# EAGLE board fiberInterface_revC_V3 (EAGLE 9.1.1)
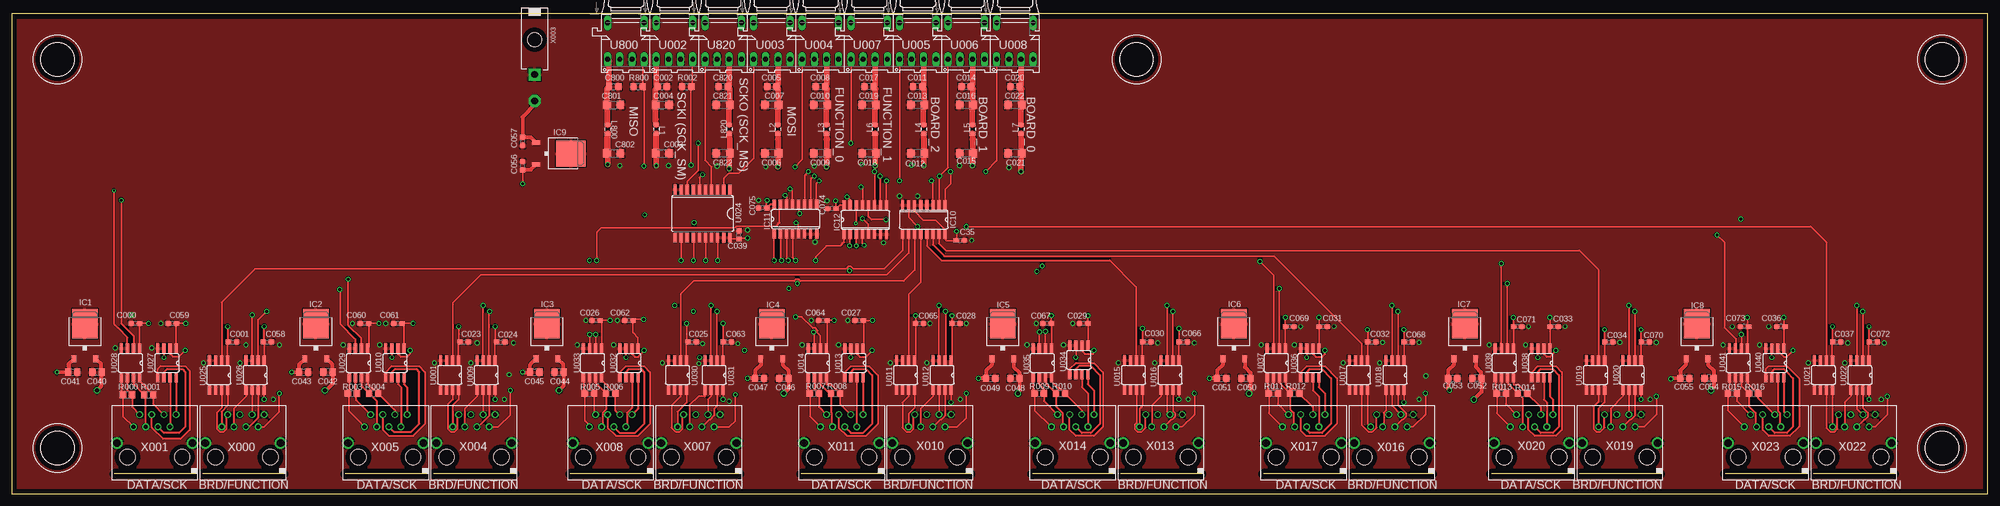
[diagram p2: board, top side]
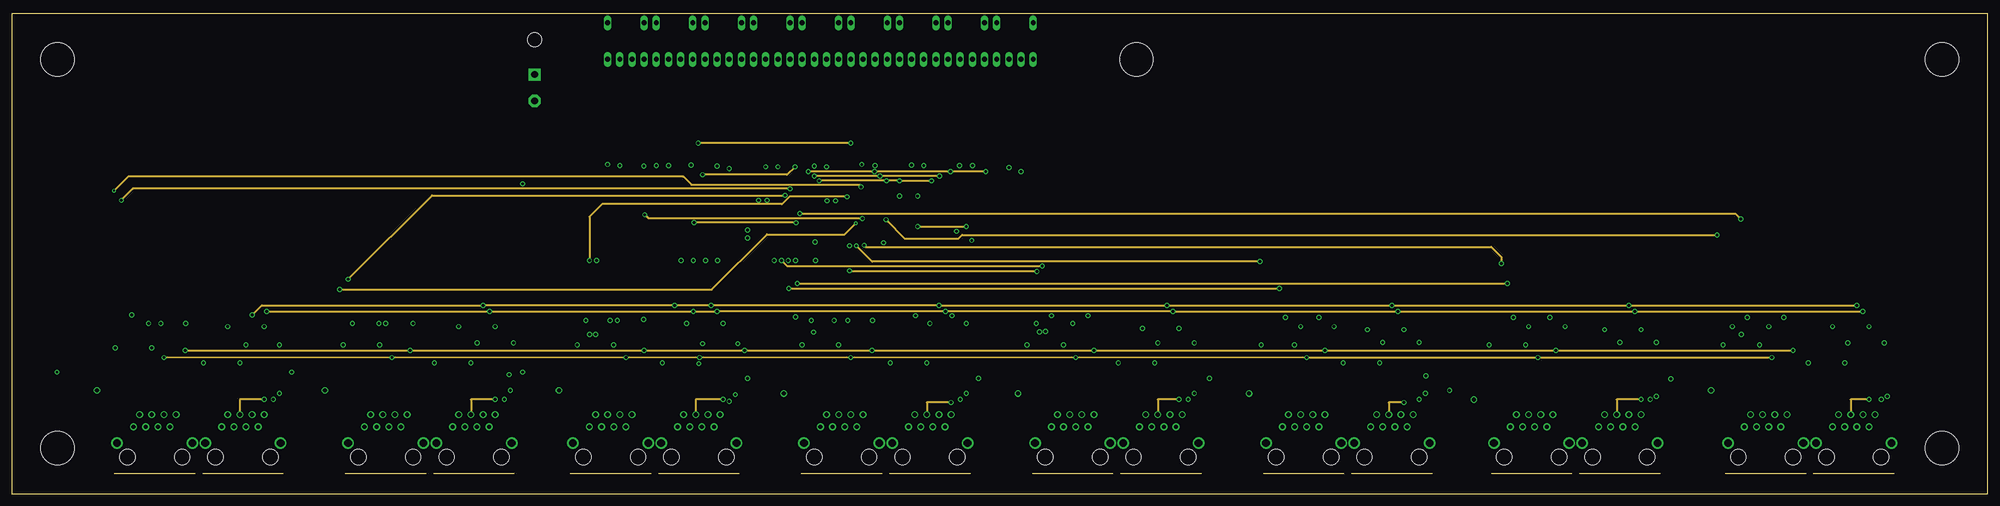
[diagram p3: board, inner layer Signal]
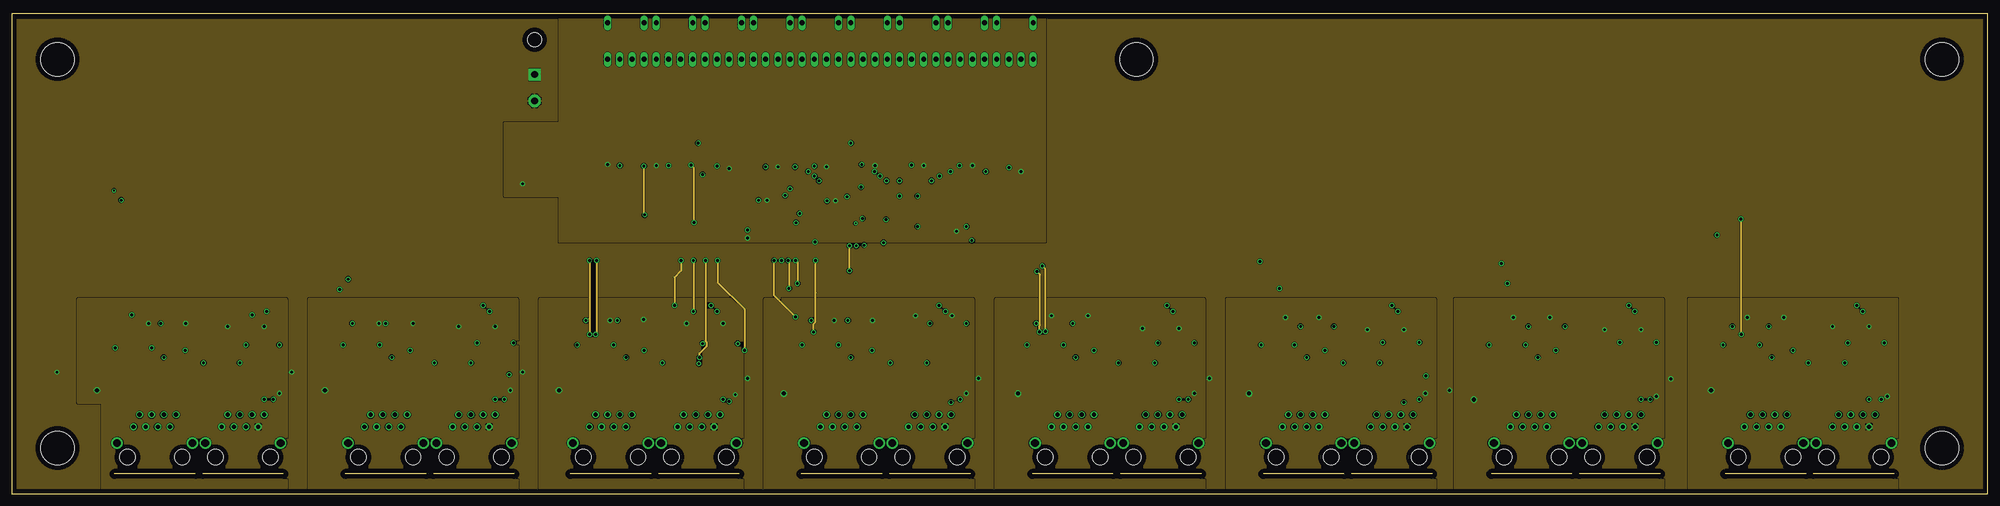
[diagram p4: board, inner layer VCC]
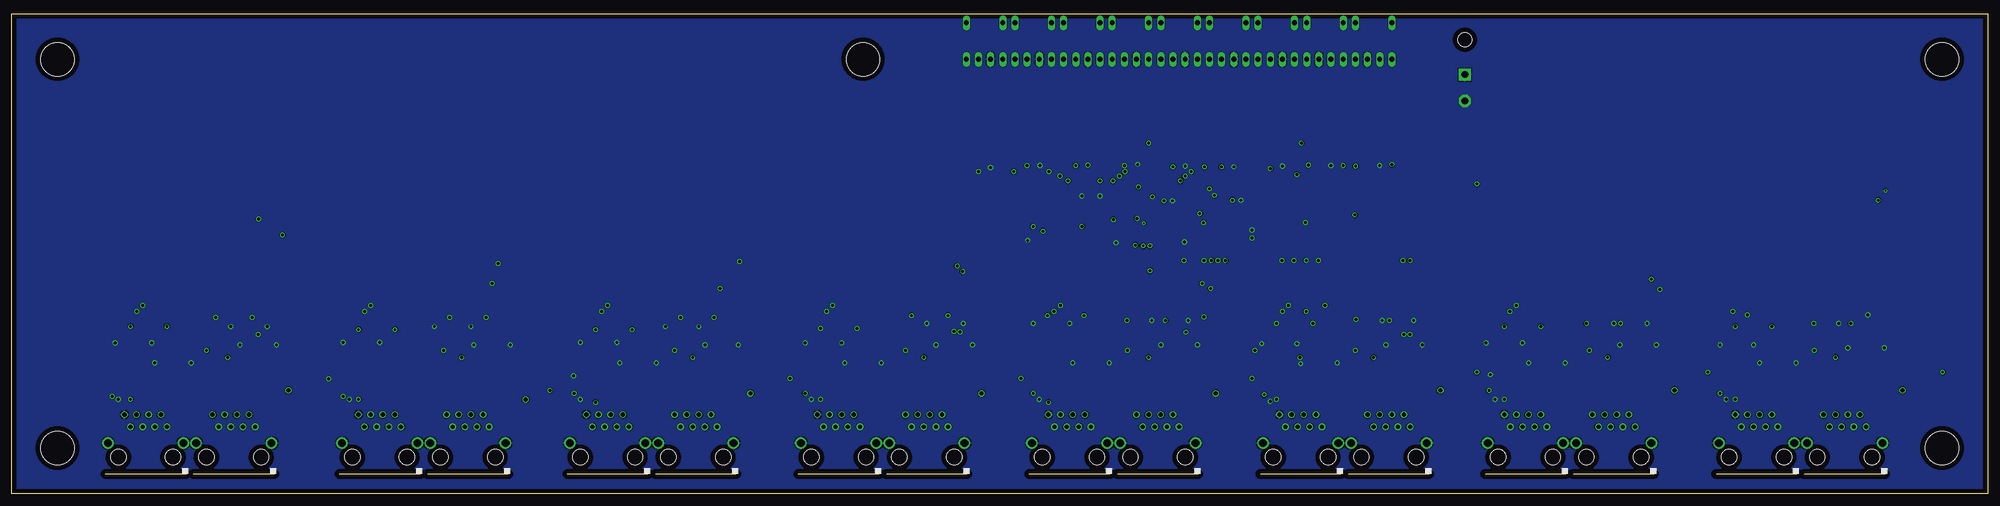
[diagram p5: board, bottom side, seen from below]

Size 412.75 x 100.33 mm. Coordinates in mm from the lower left corner, seen from the top.
Outline: 0,0 412.75,0 412.75,100.33 0,100.33 0,0
Copper layers (1*2*15*16): GND_TOP 0.035mm / dielectric 0.5mm / Signal 0.035mm / dielectric 0.5mm / VCC 0.035mm / dielectric 0.5mm / GND_BOTTOM 0.035mm
Design rules "default *": minimum track width 10mil, minimum drill 10mil, track to track 5mil, track to pad 5mil, pad to pad 8mil, via to via 8mil, smd to smd 8mil, copper to edge 40mil, drill to drill 8mil, minimum pad ring 10mil, minimum via ring 8mil, stop-mask expansion 4mil, vias tented up to drill 0mil, thermal gap 10mil
Holes 6.99 mm at 403.23,9.53 9.53,90.81 403.23,90.81 234.95,90.81 9.53,9.53
tKeepout: area 398.1,4.4 to 408.3,14.6; area 4.4,85.7 to 14.6,95.9; area 398.1,85.7 to 408.3,95.9; area 229.9,85.7 to 240,95.9; area 4.4,4.4 to 14.6,14.6

## Footprints (pad centres in the part's own frame; a part is rotated, then mirrored left to right if it is on the bottom)
C0603 = smd 1.1 x 1: 1 -0.85,0; 2 0.85,0
C0805 = smd 1.3 x 1.5: 1 -0.95,0; 2 0.95,0
C1206 = smd 1.6 x 1.8: 1 -1.4,0; 2 1.4,0
TO252 = smd 1 x 1.6: 1 -2.28,-4.8; 2 2.28,-4.8 | smd 5.4 x 6.2: 3 0,2.5
SO16 = smd 0.66 x 2.032: 1 -4.445,-3.073; 2 -3.175,-3.073; 3 -1.905,-3.073; 4 -0.635,-3.073; 5 0.635,-3.073; 6 1.905,-3.073; 7 3.175,-3.073; 8 4.445,-3.073; 9 4.445,3.073; 10 3.175,3.073; 11 1.905,3.073; 12 0.635,3.073; 13 -0.635,3.073; 14 -1.905,3.073; 15 -3.175,3.073; 16 -4.445,3.073
0805 = smd 0.8 x 1.2: 1 -0.9,0; 2 0.9,0
R0805 = smd 1.3 x 1.5: 1 -0.95,0; 2 0.95,0
SO08-1 = smd 0.66 x 2.032: 1 -1.905,-3.073; 2 -0.635,-3.073; 3 0.635,-3.073; 4 1.905,-3.073; 5 1.905,3.073; 6 0.635,3.073; 7 -0.635,3.073; 8 -1.905,3.073
HFBR-15X3 = drill 1.016 long: 1 3.81,9.525; 2 1.27,9.525; 3 -1.27,9.525; 4 -3.81,9.525; 5 -3.81,1.905; 8 3.81,1.905
SO20W = smd 0.66 x 2.032: 1 -5.715,-5.029; 2 -4.445,-5.029; 3 -3.175,-5.029; 4 -1.905,-5.029; 5 -0.635,-5.029; 6 0.635,-5.029; 7 1.905,-5.029; 8 3.175,-5.029; 9 4.445,-5.029; 10 5.715,-5.029; 11 5.715,5.029; 12 4.445,5.029; 13 3.175,5.029; 14 1.905,5.029; 15 0.635,5.029; 16 -0.635,5.029; 17 -1.905,5.029; 18 -3.175,5.029; 19 -4.445,5.029; 20 -5.715,5.029
RJ45-VERTICAL = drill 0.9 pad 1.4: 1 -4.445,6.35; 2 -3.175,8.89; 3 -1.905,6.35; 4 -0.635,8.89; 5 0.635,6.35; 6 1.905,8.89; 7 3.175,6.35; 8 4.445,8.89 | drill 1.6 pad 2.1: G1 -7.875,2.95; G2 7.875,2.95 | hole 3.251: -5.715,0; 5.715,0
39-30-?02? = drill 1.422 pad 2.54 square: 1 0,0 | drill 1.422 pad 2.54 octagon: 2 0,5.512 | hole 3: 0,-7.3

## Placement (x,y rotation side)
C000  0.1uF  [C0603]  25.78,35.56 180 top
C001  0.1uF  [C0603]  46.1,31.75 0 top
C002  100n  [C0805]  135.89,85.09 0 top
C003  10u  [C1206]  135.89,71.12 0 top
C004  10u  [C1206]  135.89,81.28 0 top
C005  100n  [C0805]  158.75,85.09 180 top
C006  10u  [C1206]  158.75,71.12 180 top
C007  10u  [C1206]  158.75,81.28 180 top
C008  100n  [C0805]  168.91,85.09 180 top
C009  10u  [C1206]  168.91,71.12 180 top
C010  10u  [C1206]  168.91,81.28 180 top
C011  100n  [C0805]  189.23,85.09 180 top
C012  10u  [C1206]  189.23,71.12 180 top
C013  10u  [C1206]  189.23,81.28 180 top
C014  100n  [C0805]  199.39,85.09 180 top
C015  10u  [C1206]  199.39,71.12 180 top
C016  10u  [C1206]  199.39,81.28 180 top
C017  100n  [C0805]  179.07,85.09 180 top
C018  10u  [C1206]  179.07,71.12 180 top
C019  10u  [C1206]  179.07,81.28 180 top
C020  100n  [C0805]  209.55,85.09 180 top
C021  10u  [C1206]  209.55,71.12 180 top
C022  10u  [C1206]  209.55,81.28 180 top
C023  0.1uF  [C0603]  94.49,31.75 0 top
C024  0.1uF  [C0603]  102.11,31.75 0 top
C025  0.1uF  [C0603]  142.11,31.75 0 top
C026  0.1uF  [C0603]  122.05,36.2 180 top
C027  0.1uF  [C0603]  177.04,36.2 180 top
C028  0.1uF  [C0603]  197.23,35.56 0 top
C029  0.1uF  [C0603]  223.9,35.56 180 top
C030  0.1uF  [C0603]  237.11,31.75 0 top
C031  0.1uF  [C0603]  273.94,34.92 0 top
C032  0.1uF  [C0603]  284.1,31.75 0 top
C033  0.1uF  [C0603]  322.2,34.92 0 top
C034  0.1uF  [C0603]  333.63,31.75 0 top
C35  0.1uF  [C0603]  198.12,52.96 0 top
C036  0.1uF  [C0603]  369.57,34.92 180 top
C037  0.1uF  [C0603]  381.25,31.75 0 top
C039  0.1uF  [C0603]  151.89,54.1 90 top
C040  0.1uF  [C0805]  17.78,25.4 180 top
C041  0.33uF  [C0805]  12.7,25.4 0 top
C042  0.1uF  [C0805]  66.04,25.4 180 top
C043  0.33uF  [C0805]  60.96,25.4 0 top
C044  0.1uF  [C0805]  114.3,25.4 180 top
C045  0.33uF  [C0805]  109.22,25.4 0 top
C046  0.1uF  [C0805]  161.29,24.13 180 top
C047  0.33uF  [C0805]  156.21,24.13 0 top
C048  0.1uF  [C0805]  209.55,24.13 180 top
C049  0.33uF  [C0805]  204.47,24.13 0 top
C050  0.1uF  [C0805]  257.81,24.13 180 top
C051  0.33uF  [C0805]  252.73,24.13 0 top
C052  0.1uF  [C0805]  306.07,24.13 180 top
C053  0.33uF  [C0805]  300.99,24.13 0 top
C054  0.1uF  [C0805]  354.58,24.13 180 top
C055  0.33uF  [C0805]  349.5,24.13 0 top
C056  0.1uF  [C0603]  106.68,68.58 90 top
C057  0.1uF  [C0603]  106.68,73.66 270 top
C058  0.1uF  [C0603]  53.34,31.75 0 top
C059  0.1uF  [C0603]  33.53,35.56 180 top
C060  0.1uF  [C0603]  73.66,35.56 180 top
C061  0.1uF  [C0603]  80.64,35.56 180 top
C062  0.1uF  [C0603]  128.91,36.2 180 top
C063  0.1uF  [C0603]  149.48,31.75 0 top
C064  0.1uF  [C0603]  169.42,36.2 180 top
C065  0.1uF  [C0603]  189.61,35.56 0 top
C066  0.1uF  [C0603]  244.73,31.75 0 top
C067  0.1uF  [C0603]  216.28,35.56 180 top
C068  0.1uF  [C0603]  291.72,31.75 0 top
C069  0.1uF  [C0603]  266.95,34.92 0 top
C070  0.1uF  [C0603]  341.25,31.75 0 top
C071  0.1uF  [C0603]  314.58,34.92 0 top
C072  0.1uF  [C0603]  388.87,31.75 0 top
C073  0.1uF  [C0603]  361.95,34.92 180 top
C074  0.1uF  [C0603]  171.32,59.56 180 top
C075  0.1uF  [C0603]  156.84,59.69 180 top
C800  100n  [C0805]  125.73,85.09 0 top
C801  10u  [C1206]  125.73,81.28 0 top
C802  10u  [C1206]  125.73,71.12 0 top
C820  100n  [C0805]  148.59,85.09 180 top
C821  10u  [C1206]  148.59,81.28 180 top
C822  10u  [C1206]  148.59,71.12 180 top
IC1  7833  [TO252]  15.24,33.02 0 top
IC2  7833  [TO252]  63.5,33.02 0 top
IC3  7833  [TO252]  111.76,33.02 0 top
IC4  7833  [TO252]  158.75,33.02 0 top
IC5  7833  [TO252]  207.01,33.02 0 top
IC6  7833  [TO252]  255.27,33.02 0 top
IC7  7833  [TO252]  303.53,33.02 0 top
IC8  7833  [TO252]  352.04,33.02 0 top
IC9  7805DT  [TO252]  114.3,71.12 270 top
IC10  74LS138D  [SO16]  190.5,57.28 180 top
IC11  74LS151D  [SO16]  163.7,57.4 0 top
IC12  74LS151D  [SO16]  178.31,57.28 0 top
L1  1u  [0805]  134.62,76.2 270 top
L2  1u  [0805]  160.02,76.2 270 top
L3  1u  [0805]  170.18,76.2 270 top
L4  1u  [0805]  190.5,76.2 270 top
L5  1u  [0805]  200.66,76.2 270 top
L6  1u  [0805]  180.34,76.2 270 top
L7  1u  [0805]  210.82,76.2 270 top
L800  1u  [0805]  124.46,76.2 270 top
L820  1u  [0805]  149.86,76.2 270 top
R000  100  [R0805]  24.13,20.7 0 top
R001  100  [R0805]  28.57,20.7 0 top
R002  4.7k  [R0805]  140.97,85.09 0 top
R003  100  [R0805]  71.12,20.95 0 top
R004  100  [R0805]  75.56,20.95 0 top
R005  100  [R0805]  120.65,20.95 0 top
R006  100  [R0805]  125.09,20.95 0 top
R007  100  [R0805]  167.64,20.95 0 top
R008  100  [R0805]  172.09,20.95 0 top
R009  100  [R0805]  214.63,20.95 0 top
R010  100  [R0805]  219.07,20.95 0 top
R011  100  [R0805]  263.52,20.95 0 top
R012  100  [R0805]  267.97,20.95 0 top
R013  100  [R0805]  311.15,20.95 0 top
R014  100  [R0805]  315.6,20.95 0 top
R015  100  [R0805]  359.41,20.95 0 top
R016  100  [R0805]  363.86,20.95 0 top
R800  4.7k  [R0805]  130.81,85.09 0 top
U001  65LVDS9638  [SO08-1]  91.44,24.77 180 top
U002  AFBR-1629Z  [HFBR-15X3]  138.43,100.33 180 top
U003  AFBR-2529Z  [HFBR-15X3]  158.75,100.33 180 top
U004  AFBR-2529Z  [HFBR-15X3]  168.91,100.33 180 top
U005  AFBR-2529Z  [HFBR-15X3]  189.23,100.33 180 top
U006  AFBR-2529Z  [HFBR-15X3]  199.39,100.33 180 top
U007  AFBR-2529Z  [HFBR-15X3]  179.07,100.33 180 top
U008  AFBR-2529Z  [HFBR-15X3]  209.55,100.33 180 top
U009  65LVDS9638  [SO08-1]  99.06,24.77 180 top
U010  65LVDS9638  [SO08-1]  80.01,27.3 180 top
U011  65LVDS9638  [SO08-1]  186.69,24.77 180 top
U012  65LVDS9638  [SO08-1]  194.31,24.77 180 top
U013  65LVDS9638  [SO08-1]  175.9,27.3 180 top
U014  65LVDS34  [SO08-1]  168.28,27.3 180 top
U015  65LVDS9638  [SO08-1]  234.31,24.77 180 top
U016  65LVDS9638  [SO08-1]  241.94,24.77 180 top
U017  65LVDS9638  [SO08-1]  281.31,24.77 180 top
U018  65LVDS9638  [SO08-1]  288.93,24.77 180 top
U019  65LVDS9638  [SO08-1]  330.83,24.77 180 top
U020  65LVDS9638  [SO08-1]  338.45,24.77 180 top
U021  65LVDS9638  [SO08-1]  378.46,24.77 180 top
U022  65LVDS9638  [SO08-1]  386.08,24.77 180 top
U024  74LS244DW  [SO20W]  144.27,58.55 180 top
U025  65LVDS9638  [SO08-1]  43.18,24.77 180 top
U026  65LVDS9638  [SO08-1]  50.8,24.77 180 top
U027  65LVDS9638  [SO08-1]  32.38,27.3 180 top
U028  65LVDS34  [SO08-1]  24.77,27.3 180 top
U029  65LVDS34  [SO08-1]  72.39,27.3 180 top
U030  65LVDS9638  [SO08-1]  139.06,24.77 180 top
U031  65LVDS9638  [SO08-1]  146.69,24.77 180 top
U032  65LVDS9638  [SO08-1]  128.91,27.3 180 top
U033  65LVDS34  [SO08-1]  121.28,27.3 180 top
U034  65LVDS9638  [SO08-1]  222.88,27.94 180 top
U035  65LVDS34  [SO08-1]  215.26,27.3 180 top
U036  65LVDS9638  [SO08-1]  271.14,27.3 180 top
U037  65LVDS34  [SO08-1]  264.16,27.3 180 top
U038  65LVDS9638  [SO08-1]  319.4,27.3 180 top
U039  65LVDS34  [SO08-1]  311.79,27.3 180 top
U040  65LVDS9638  [SO08-1]  368.3,27.3 180 top
U041  65LVDS34  [SO08-1]  360.68,27.3 180 top
U800  AFBR-1629Z  [HFBR-15X3]  128.27,100.33 180 top
U820  AFBR-2529Z  [HFBR-15X3]  148.59,100.33 180 top
X000  RJ45V  [RJ45-VERTICAL]  48.26,7.62 0 top
X001  RJ45V  [RJ45-VERTICAL]  29.84,7.62 0 top
X003  39-30-02?_S  [39-30-?02?]  109.22,87.63 180 top
X004  RJ45V  [RJ45-VERTICAL]  96.52,7.62 0 top
X005  RJ45V  [RJ45-VERTICAL]  78.11,7.62 0 top
X007  RJ45V  [RJ45-VERTICAL]  143.51,7.62 0 top
X008  RJ45V  [RJ45-VERTICAL]  125.09,7.62 0 top
X010  RJ45V  [RJ45-VERTICAL]  191.77,7.62 0 top
X011  RJ45V  [RJ45-VERTICAL]  173.35,7.62 0 top
X013  RJ45V  [RJ45-VERTICAL]  240.03,7.62 0 top
X014  RJ45V  [RJ45-VERTICAL]  221.62,7.62 0 top
X016  RJ45V  [RJ45-VERTICAL]  288.29,7.62 0 top
X017  RJ45V  [RJ45-VERTICAL]  269.88,7.62 0 top
X019  RJ45V  [RJ45-VERTICAL]  335.92,7.62 0 top
X020  RJ45V  [RJ45-VERTICAL]  317.5,7.62 0 top
X022  RJ45V  [RJ45-VERTICAL]  384.81,7.62 0 top
X023  RJ45V  [RJ45-VERTICAL]  366.39,7.62 0 top

## Tracks (layer width: path | path; a pad name or v marks a point on that pad's centre or on a via)
+5V  (via drill 0.6)
  GND_TOP 0.254: C021.1 210.95,70.64 210.95,70.41 210.82,69.85
  GND_TOP 0.406: v153.67,53.47 153.26,53.44 152.04,53.44 151.89,53.29 C039.1 150.25,53.25 U024.20 | C056.1 v106.68,64.77 | 194.31,55.88 194.94,55.24 IC10.16 194.94,53.21 195.2,52.96 197.36,52.96 | 194.31,55.88 193.04,57.15 190.5,57.15 188.59,59.05 IC10.6 | v157.73,61.34 157.69,61.3 C075.1 158.48,60.48 IC11.16 | IC12.16 173.04,60.35 172.32,59.63 C074.1 172.09,59.65 v172.09,61.21 | v197.36,54.86 197.36,52.96 | 197.36,52.96 197.36,52.67 C35.1 | 194.31,55.88
  GND_TOP 0.813: C056.1 108.39,67.73 IC9.2
  GND_TOP 1.27: C802.1 124.33,74.07 L800.2 v124.46,68.83 | L820.2 149.99,74.07 C822.1 149.86,71.12 v149.86,67.94 | C003.1 134.62,71.12 L1.2 v134.62,68.58 | C006.1 160.15,74.07 | 160.15,74.07 L2.2 | C009.1 170.31,74.07 | 170.31,74.07 L3.2 | C012.1 190.63,74.07 | 190.63,74.07 L4.2 | C015.1 200.79,74.07 | 200.79,74.07 L5.2 | C021.1 210.95,74.07 L7.2 | v210.82,67.31 210.82,69.85 | 160.15,74.07 160.02,74.07 v160.02,68.33 | 170.31,74.07 170.18,74.07 v170.18,68.33 | 190.63,74.07 190.5,74.07 v190.5,68.58 | 200.79,74.07 200.66,74.07 v200.66,68.58 | v180.34,68.58 180.34,71.12 C018.1 180.47,75.17 L6.2
  pour VCC: 114.3,100.33 114.3,77.47 102.87,77.47 102.87,62.23 114.3,62.23 114.3,52.7 215.9,52.7 215.9,100.33
+12V  (via drill 0.6)
  GND_TOP 0.406: IC3.1 109.4,28.14
  GND_TOP 0.813: v9.4,25.4 C041.1 11.94,25.4 11.82,25.52 11.82,26.65 11.85,27.11 IC1.1 | v58.42,25.4 C043.1 60.01,27.01 IC2.1 | v250.19,24.13 C051.1 251.78,25.74 252.99,26.95 IC6.1 | X003.2 109.22,81.28 106.68,78.74 C057.1 108.39,74.51 IC9.1 | v300.36,21.59 300.04,21.91 C053.1 300.04,25.74 301.25,26.95 IC7.1 | 109.4,28.14 108.27,27.01 C045.1 v106.68,25.4 | v346.58,24 346.71,24.13 C055.1 348.55,25.74 349.76,26.95 IC8.1 | IC4.1 156.47,26.95 155.26,25.74 C047.1 v153.67,24.13 | IC5.1 204.73,26.95 203.52,25.74 C049.1 v201.93,24.13
  pour VCC (rank 4): 412.75,99.06 412.75,0 0,0 0,99.06
BOARD_0_F  (via drill 0.6)
  GND_TOP 0.406: U008.1 205.74,69.6 v203.45,67.31 | v180.21,67.31 IC12.11 | IC11.11 165.61,66.55 v166.37,67.31 | IC10.1 194.94,63.63 196.09,64.77 v196.09,67.31
  Signal 0.406: v203.45,67.31 v196.09,67.31 v180.21,67.31 v166.37,67.31
BOARD_0Y
  GND_TOP 0.406: U025.8 45.09,18.41 43.81,17.14 X000.1
BOARD_0Z
  GND_TOP 0.406: U025.7 43.81,17.9 42.78,16.86 42.78,13.54 43.39,12.94 44.24,12.94 44.85,13.54 44.85,16.27 X000.2
BOARD_1_F  (via drill 0.6)
  GND_TOP 0.406: v167.64,66.42 166.88,65.66 IC11.10 | U006.1 195.58,68.2 v193.8,66.42 193.68,66.29 IC10.2 | IC12.10 181.36,60.48 v181.36,66.42
  Signal 0.406: v193.8,66.42 v181.36,66.42 v167.64,66.42
BOARD_1Y
  GND_TOP 0.406: U001.8 93.34,19.68 92.08,18.41 X004.1
BOARD_1Z
  GND_TOP 0.406: U001.7 92.08,19.68 91.04,18.65 91.04,13.54 91.65,12.94 92.5,12.94 93.11,13.54 93.11,16.27 X004.2
BOARD_2_F  (via drill 0.6)
  GND_TOP 0.406: U005.1 v185.42,65.41 | IC10.3 192.41,65.15 v192.15,65.41 | IC11.9 168.15,64.9 v168.66,65.41 | IC12.9 v182.75,65.41
  Signal 0.406: v192.15,65.41 v185.42,65.41 v182.75,65.41 v168.66,65.41
BOARD_2Y
  GND_TOP 0.406: U030.8 140.97,19.05 139.06,17.14 X007.1
BOARD_2Z
  GND_TOP 0.406: X007.2 140.1,16.27 140.1,13.54 139.49,12.94 138.64,12.94 137.79,13.78 137.79,18.41 139.7,20.32 U030.7
BOARD_3Y
  GND_TOP 0.406: U011.8 188.59,17.97 187.32,16.7 X010.1
BOARD_3Z
  GND_TOP 0.406: X010.2 188.36,16.27 188.36,13.54 187.75,12.94 186.9,12.94 186.06,13.78 186.06,19.05 187.32,20.32 U011.7
BOARD_4Y
  GND_TOP 0.406: X013.1 235.59,17.78 236.22,18.41 U015.8
BOARD_4Z
  GND_TOP 0.406: U015.7 234.95,14.8 234.55,14.4 234.55,13.54 235.16,12.94 236.01,12.94 236.85,13.78 X013.2
BOARD_5Y
  GND_TOP 0.406: U017.8 283.21,14.61 X016.1
BOARD_5Z
  GND_TOP 0.406: X016.2 285.12,13.78 284.27,12.94 283.42,12.94 281.94,14.41 U017.7
BOARD_6Y
  GND_TOP 0.406: X019.1 331.47,17.78 332.74,19.05 U019.8
BOARD_6Z
  GND_TOP 0.406: U019.7 331.47,19.17 330.44,18.14 330.44,13.54 331.04,12.94 331.9,12.94 332.74,13.78 X019.2
BOARD_7Y
  GND_TOP 0.406: U021.8 X022.1
BOARD_7Z
  GND_TOP 0.406: X022.2 381.4,16.27 381.4,13.54 380.79,12.94 379.94,12.94 379.1,13.78 U021.7
FUNCTION_0  (via drill 0.6)
  GND_TOP 0.406: U031.2 v147.32,38.1 | v195.07,38.1 195.07,27.96 U012.2 | v289.56,38.1 U018.2 | v339.09,38.1 U020.2 | v386.71,38.1 U022.2 | U016.2 v242.57,38.1 | U009.2 99.69,37.97 v99.82,38.1 | U024.14 v142.37,48.77 | v53.21,38.1 51.44,36.32 U026.2
  Signal 0.406: v53.21,38.1 v99.82,38.1 v142.37,38.1 v147.32,38.1 v195.07,38.1 v242.57,38.1 v289.56,38.1 v339.09,38.1 v386.71,38.1
  VCC 0.406: v142.37,48.77 v142.37,38.1
FUNCTION_0_0Y  (via drill 0.6)
  GND_TOP 0.406: v52.7,19.68 U026.8
  Signal 0.406: v52.7,19.68 47.62,19.68 X000.4
FUNCTION_0_0Z
  GND_TOP 0.406: U026.7 51.44,15.88 49.53,13.97 X000.5
FUNCTION_0_1Y  (via drill 0.6)
  GND_TOP 0.406: U009.8 v100.97,19.68
  Signal 0.406: X004.4 95.89,19.68 v100.97,19.68
FUNCTION_0_1Z
  GND_TOP 0.406: U009.7 99.69,16.32 97.35,13.97 X004.5
FUNCTION_0_2Y  (via drill 0.6)
  GND_TOP 0.406: U031.8 v148.59,19.68
  Signal 0.406: X007.4 142.88,19.68 v148.59,19.68
FUNCTION_0_2Z
  GND_TOP 0.406: U031.7 147.32,18.39 146.71,17.78 146.71,16.34 145.84,15.48 145.65,15.48 X007.5
FUNCTION_0_3Y  (via drill 0.6)
  GND_TOP 0.406: U012.8 v196.22,19.05
  Signal 0.406: X010.4 191.13,19.05 v196.22,19.05
FUNCTION_0_3Z
  GND_TOP 0.406: X010.5 193.91,15.48 194.1,15.48 194.94,16.32 U012.7
FUNCTION_0_4Y  (via drill 0.6)
  GND_TOP 0.406: U016.8 v243.84,19.68
  Signal 0.406: X013.4 239.4,19.68 v243.84,19.68
FUNCTION_0_4Z
  GND_TOP 0.406: U016.7 242.57,17.34 242.97,16.94 242.97,16.08 242.36,15.48 242.17,15.48 X013.5
FUNCTION_0_5Y  (via drill 0.6)
  GND_TOP 0.406: U018.8 v290.83,19.05
  Signal 0.406: X016.4 287.65,19.05 v290.83,19.05
FUNCTION_0_5Z
  GND_TOP 0.406: X016.5 290.43,15.48 290.62,15.48 291.23,16.08 291.23,16.94 289.56,18.61 U018.7
FUNCTION_0_6Y  (via drill 0.6)
  GND_TOP 0.406: U020.8 v340.36,19.68
  Signal 0.406: X019.4 335.28,19.68 v340.36,19.68
FUNCTION_0_6Z
  GND_TOP 0.406: X019.5 338.06,15.48 338.25,15.48 339.09,16.32 U020.7
FUNCTION_0_7Y  (via drill 0.6)
  GND_TOP 0.406: U022.8 v387.99,19.68
  Signal 0.406: X022.4 384.18,19.68 v387.99,19.68
FUNCTION_0_7Z
  GND_TOP 0.406: U022.7 386.71,17.97 387.75,16.94 387.75,16.08 387.14,15.48 386.95,15.48 X022.5
FUNCTION_0_F  (via drill 0.6)
  GND_TOP 0.406: U004.1 165.1,69.85 v163.58,68.33 | v144.27,66.67 143.64,66.04 U024.6
  Signal 0.406: v144.27,66.67 161.93,66.67 v163.58,68.33
FUNCTION_1  (via drill 0.6)
  GND_TOP 0.406: U026.3 v50.16,37.34 | U009.3 v98.42,39.37 | U031.3 v146.05,39.37 | v241.3,39.37 U016.3 | v288.29,39.37 U018.3 | v337.82,39.37 U020.3 | v385.44,39.37 U022.3 | U024.12 v139.83,48.77 | U012.3 v193.68,39.37
  Signal 0.406: v385.44,39.37 v337.82,39.37 v288.29,39.37 v241.3,39.37 v193.68,39.37 v146.05,39.37 v138.43,39.37 v98.42,39.37 52.2,39.37 v50.16,37.34
  VCC 0.406: v139.83,48.77 139.83,46.61 138.43,45.21 v138.43,39.37
FUNCTION_1_0Y
  GND_TOP 0.406: U026.6 X000.6
FUNCTION_1_0Z
  GND_TOP 0.406: X000.3 46.35,17.78 48.9,20.32 U026.5
FUNCTION_1_1Y
  GND_TOP 0.406: U009.6 X004.6
FUNCTION_1_1Z
  GND_TOP 0.406: X004.3 94.61,17.78 97.16,20.32 U009.5
FUNCTION_1_2Y
  GND_TOP 0.406: X007.6 145.41,19.68 146.05,20.32 U031.6
FUNCTION_1_2Z
  GND_TOP 0.406: X007.3 141.6,18.52 143.41,20.32 144.78,20.32 U031.5
FUNCTION_1_3Y
  GND_TOP 0.406: U012.6 X010.6
FUNCTION_1_3Z
  GND_TOP 0.406: X010.3 189.87,17.78 192.41,20.32 U012.5
FUNCTION_1_4Y
  GND_TOP 0.406: U016.6 241.3,17.14 X013.6
FUNCTION_1_4Z
  GND_TOP 0.406: X013.3 238.12,18.41 240.03,20.32 U016.5
FUNCTION_1_5Y
  GND_TOP 0.406: U018.6 288.29,18.41 X016.6
FUNCTION_1_5Z
  GND_TOP 0.406: U018.5 287.02,17.34 286.62,16.94 286.62,14.21 X016.3
FUNCTION_1_6Y
  GND_TOP 0.406: U020.6 X019.6
FUNCTION_1_6Z
  GND_TOP 0.406: X019.3 334.01,17.78 336.55,20.32 U020.5
FUNCTION_1_7Y
  GND_TOP 0.406: U022.6 385.44,17.78 X022.6
FUNCTION_1_7Z
  GND_TOP 0.406: X022.3 382.9,19.05 384.18,20.32 U022.5
FUNCTION_1_F  (via drill 0.6)
  GND_TOP 0.406: U007.1 v175.26,73.28 | U024.8 141.1,65.28 143.38,67.56 v143.38,73.28
  Signal 0.406: v175.26,73.28 v143.38,73.28
GND  (via drill 0.6)
  other vias: 208.28,68.2 197.99,68.58 167.64,68.45 157.48,68.33 147.32,68.45 137.16,68.58 127,68.58 177.55,68.83 25.02,37.34 153.67,55.12 200.53,52.96 295.4,24.64 103.89,24.89 48.9,31.11 55.88,31.11 40.01,27.3 47.62,27.3 21.59,30.48 31.11,35.56 29.21,30.48 71.12,35.56 69.22,31.11 78.11,35.56 76.83,31.11 88.27,27.3 95.89,27.3 97.16,31.5 104.78,31.5 118.11,31.11 119.89,36.2 126.49,36.2 125.73,31.11 144.27,31.37 135.89,27.3 143.51,27.18 151.64,31.37 54.61,19.68 102.87,19.68 149.86,19.3 165.1,31.11 167,36.2 172.72,31.11 174.62,36.2 183.51,27.3 191.13,27.3 198.12,19.68 199.39,35.56 191.77,35.56 212.09,31.11 219.71,31.11 214,35.56 221.62,35.56 231.14,27.3 238.76,27.3 247.01,31.5 239.4,31.5 245.75,19.68 269.24,34.92 276.23,34.92 278.13,27.3 285.75,27.3 286.38,31.62 294,31.62 294,19.68 267.97,31.11 260.99,31.11 324.49,34.92 316.87,34.92 308.61,31.11 316.23,31.11 342.26,19.68 335.92,31.62 343.54,31.62 359.41,34.92 357.5,31.11 365.12,31.11 367.03,34.92 390.52,19.68 383.54,31.5 391.16,31.5 382.9,27.3 375.29,27.3 185.42,62.23 189.23,62.23 170.31,61.21 155.96,61.34 167.77,52.58 182.12,52.45
  pour GND_TOP: 0,99.06 412.75,99.06 412.75,0 0,0
  pour GND_BOTTOM: 0,100.33 412.75,100.33 412.75,0 0,0
MISO  (via drill 0.6)
  GND_TOP 0.406: U800.4 131.76,90.81 R800.2 132.08,85.09 132.08,68.58 v132.02,68.52 | IC12.5 178.94,56.26 v177.67,57.53
  Signal 0.406: v177.67,57.53 132.97,57.53 v132.21,58.29
  VCC 0.406: v132.21,58.29 132.02,58.48 v132.02,68.52
MISO_0  (via drill 0.35, 0.6)
  GND_TOP 0.406: v177.42,64.14 177.67,63.88 IC12.13 | U028.3 24.13,32.64 22.17,34.6 22.13,34.6 21.32,35.41 v21.32,63.35
  Signal 0.406: v177.42,64.14 176.98,64.57 141.99,64.57 140.27,66.28 24.25,66.28 v21.32,63.35
MISO_1  (via drill 0.35, 0.6)
  GND_TOP 0.406: IC12.14 176.33,60.14 176.4,60.22 176.4,56.64 v176.28,56.52 | v68.45,42.67 68.57,42.55 68.57,35.43 71.75,32.25 U029.3
  Signal 0.406: v68.45,42.67 146.18,42.67 157.73,54.23 173.99,54.23 v176.28,56.52
MISO_2  (via drill 0.6)
  GND_TOP 0.406: IC12.15 175.13,61.47 174.53,62.07 v174.49,62.07 | v120.71,33.27 120.71,30.44 U033.3
  Signal 0.406: v174.49,62.07 162.42,62.07 160.86,60.51 123.25,60.51 120.65,57.91 v120.65,48.77
  VCC 0.406: v120.65,48.77 120.65,36.61 120.72,36.54 120.72,35.85 120.71,35.84 v120.71,33.27
MISO_3  (via drill 0.6)
  GND_TOP 0.406: U014.3 167.64,33.62 v167.5,33.76 | IC12.1 173.86,52.58 173.1,51.82 170.18,51.82 167.89,49.53 v167.89,48.77
  VCC 0.406: v167.5,33.76 167.5,35.51 167.84,35.85 167.84,41.91 167.89,41.97 v167.89,48.77
MISO_4  (via drill 0.6)
  GND_TOP 0.406: U035.3 214.63,33.72 v214.69,33.78 | v175.01,51.82 175.13,51.94 IC12.2
  Signal 0.406: v214.12,46.48 175.13,46.48 v175.01,46.61
  VCC 0.406: v214.69,33.78 214.69,35.08 214.83,35.22 214.83,45.78 v214.12,46.48 | v175.01,46.61 v175.01,51.82
MISO_5  (via drill 0.6)
  GND_TOP 0.406: v260.73,48.51 263.52,45.72 U037.3 | v176.4,51.82 IC12.3
  Signal 0.406: v260.73,48.51 179.71,48.51 v176.4,51.82
MISO_6  (via drill 0.6)
  GND_TOP 0.406: U039.3 v311.15,48.13 | v178.05,51.94 177.67,52.32 IC12.4
  Signal 0.406: v178.05,51.94 178.38,51.62 309.06,51.62 311.15,49.53 v311.15,48.13
MISO_7  (via drill 0.6)
  GND_TOP 0.406: v182.63,57.28 179.58,57.28 178.94,57.91 IC12.12 | U041.3 360.05,30.48 360.17,30.35 360.17,32.38 357.76,34.8 357.76,52.58 v356.24,54.1
  Signal 0.406: v182.63,57.28 186.63,53.27 197.7,53.27 198.54,54.1 v356.24,54.1
MISO_A_0
  GND_TOP 0.406: U028.6 24.13,21.65 R000.2 25.08,18.1 X001.2
MISO_A_1
  GND_TOP 0.406: U029.6 71.75,21.11 71.91,20.95 | 71.91,20.32 71.91,19.53 X005.2 | 71.91,20.32 71.91,20.95 | 71.91,20.95 71.91,21.11 R003.2 72.07,20.48 71.91,20.32
MISO_A_2
  GND_TOP 0.406: U033.6 120.65,21.91 R005.2 121.6,16.83 X008.2
MISO_A_3
  GND_TOP 0.406: U014.6 167.64,21.91 R007.2 168.59,18.1 X011.2
MISO_A_4
  GND_TOP 0.406: X014.2 215.58,19.37 R009.2 215.58,21.91 214.63,22.86 U035.6
MISO_A_5
  GND_TOP 0.406: U037.6 263.52,21.91 R011.2 264.48,18.73 X017.2
MISO_A_6
  GND_TOP 0.406: X020.2 312.1,18.73 R013.2 311.15,21.91 U039.6
MISO_A_7
  GND_TOP 0.406: U041.6 360.05,21.27 R015.2 360.36,19.37 X023.2
MISO_B_0
  GND_TOP 0.406: U028.5 22.86,20.95 23.11,20.7 R000.1 23.18,16.19 X001.1
MISO_B_1
  GND_TOP 0.406: U029.5 70.48,21.27 R003.1 70.46,20.67 70.46,17.17 X005.1
MISO_B_2
  GND_TOP 0.406: U033.5 119.38,21.27 R005.1 119.7,15.22 120.65,14.27 X008.1
MISO_B_3
  GND_TOP 0.406: U014.5 166.37,20.95 R007.1 166.69,16.19 X011.1
MISO_B_4
  GND_TOP 0.406: U035.5 213.36,21.27 R009.1 213.68,17.46 X014.1
MISO_B_5
  GND_TOP 0.406: U037.5 262.25,21.27 R011.1 262.57,16.82 X017.1
MISO_B_6
  GND_TOP 0.406: U039.5 309.88,21.27 R013.1 310.2,16.82 X020.1
MISO_B_7
  GND_TOP 0.406: U041.5 358.77,21.27 R015.1 358.46,17.46 X023.1
MOSI  (via drill 0.6)
  GND_TOP 0.406: v36.2,29.97 34.8,28.57 33.66,28.57 33.02,29.21 U027.2 | v83.19,29.97 83.19,29.21 82.55,28.57 81.28,28.57 80.64,29.21 U010.2 | U032.2 129.54,29.21 130.18,28.57 130.82,28.57 132.08,29.84 v132.08,29.97 | U013.2 176.53,29.21 177.16,28.57 178.44,28.57 179.71,29.84 v179.71,29.97 | U034.2 223.52,29.84 224.16,29.21 225.93,29.21 v226.06,29.97 | U036.2 271.78,29.21 272.42,28.57 273.69,28.57 274.32,29.21 v274.32,29.97 | v322.58,29.97 322.58,29.84 321.32,28.57 320.68,28.57 320.04,29.21 U038.2 | U040.2 368.94,29.84 370.19,28.57 370.84,28.57 372.11,29.84 v372.11,29.97 | U024.18 v147.45,48.77
  Signal 0.406: v36.2,29.97 v83.19,29.97 v132.08,29.97 v153.03,29.97 v179.71,29.97 v226.06,29.97 v274.32,29.97 v322.58,29.97 v372.11,29.97
  VCC 0.406: v147.45,48.77 147.45,44.2 153.03,38.61 v153.03,29.97
MOSI_A_0
  GND_TOP 0.406: U027.8 X001.8
MOSI_A_1
  GND_TOP 0.406: X005.8 82.55,22.23 81.92,22.86 U010.8
MOSI_A_2
  GND_TOP 0.406: U032.8 130.81,17.78 X008.8
MOSI_A_3
  GND_TOP 0.406: U013.8 X011.8
MOSI_A_4
  GND_TOP 0.406: U034.8 224.79,22.86 226.06,21.59 X014.8
MOSI_A_5
  GND_TOP 0.406: U036.8 273.05,22.23 274.32,20.95 X017.8
MOSI_A_6
  GND_TOP 0.406: X020.8 321.94,19.68 321.31,20.32 U038.8
MOSI_A_7
  GND_TOP 0.406: U040.8 370.2,17.14 X023.8
MOSI_B_0
  GND_TOP 0.406: U027.7 X001.7
MOSI_B_1
  GND_TOP 0.406: X005.7 81.28,22.23 80.64,22.86 U010.7
MOSI_B_2
  GND_TOP 0.406: U032.7 129.54,17.97 128.51,16.94 128.51,14.21 X008.7
MOSI_B_3
  GND_TOP 0.406: X011.7 U013.7
MOSI_B_4
  GND_TOP 0.406: X014.7 224.79,20.95 223.52,22.23 U034.7
MOSI_B_5
  GND_TOP 0.406: X017.7 273.05,20.32 271.78,21.59 U036.7
MOSI_B_6
  GND_TOP 0.406: X020.7 320.68,19.05 320.04,19.68 U038.7
MOSI_B_7
  GND_TOP 0.406: U040.7 368.94,17.34 369.33,16.94 369.33,14.21 X023.7
MOSI_F
  GND_TOP 0.406: U003.1 154.94,70.1 151.76,66.93 149.73,66.93 148.72,65.91 U024.2
N$1
  GND_TOP 1.27: L800.1 124.46,81.15 C801.1 124.33,84.64 C800.1 124.78,90.48 U800.1
N$2
  GND_TOP 1.27: L1.1 134.49,78.2 C004.1 134.49,84.64 C002.1 134.62,85.41 U002.1
N$3
  GND_TOP 1.27: L2.1 160.02,81.15 C007.1 160.15,84.64 C005.1 160.02,85.41 U003.3
N$4
  GND_TOP 1.27: L3.1 170.18,81.15 C010.1 170.31,84.64 C008.1 170.18,85.41 U004.3
N$5
  GND_TOP 1.27: L820.1 149.86,81.15 C821.1 149.99,84.64 C820.1 149.86,85.41 U820.3
N$6
  GND_TOP 1.27: L4.1 190.5,81.15 C013.1 190.63,84.64 C011.1 190.5,85.41 U005.3
N$7
  GND_TOP 1.27: L5.1 200.66,81.15 C016.1 200.79,84.64 C014.1 200.66,85.41 U006.3
N$8
  GND_TOP 1.27: L6.1 180.34,81.15 C019.1 180.47,84.64 C017.1 180.34,85.41 U007.3
N$9
  GND_TOP 1.27: L7.1 210.82,81.15 C022.1 210.95,84.64 C020.1 210.82,85.41 U008.3
N$11  (via drill 0.6)
  other vias: 187.96,68.71
RE_0
  GND_TOP 0.406: U025.2 43.81,40.01 50.8,46.99 174.21,46.99 174.66,47.44 175.35,47.44 175.8,46.99 182.25,46.99 186.06,50.8 IC10.9
RE_1
  GND_TOP 0.406: IC10.10 187.32,50.29 182.75,45.72 97.92,45.72 92.08,39.88 U001.2
RE_2
  GND_TOP 0.406: IC10.11 188.59,46.74 186.31,44.45 164.75,44.45 164.43,44.77 163.74,44.77 163.41,44.45 142.37,44.45 139.7,41.78 U030.2
RE_3
  GND_TOP 0.406: U011.2 187.32,41.66 189.87,44.2 IC10.12
RE_4
  GND_TOP 0.406: U015.2 234.88,27.91 234.88,43.25 229.36,48.77 194.18,48.77 191.13,51.82 IC10.13
RE_5
  GND_TOP 0.406: U017.2 281.94,31.37 263.65,49.66 194.82,49.66 192.41,52.07 IC10.14
RE_6
  GND_TOP 0.406: IC10.15 193.68,52.32 195.14,50.86 327.47,50.86 331.47,46.86 U019.2
RE_7  (via drill 0.6)
  GND_TOP 0.406: v189.23,55.88 187.32,57.78 IC10.7 | v199.39,55.88 375.79,55.88 379.1,52.58 U021.2
  Signal 0.406: v189.23,55.88 v199.39,55.88
SCK_MS  (via drill 0.6)
  GND_TOP 0.406: U027.3 v31.75,28.45 | U010.3 v79.38,28.45 | v128.27,28.45 U032.3 | U013.3 v175.26,28.45 | U034.3 v222.25,28.45 | U036.3 v270.51,28.45 | v318.77,28.45 U038.3 | v367.67,28.45 U040.3 | U024.16 v144.91,48.77
  Signal 0.305: v31.75,28.45 v79.38,28.45 v128.27,28.45 v143.64,28.45 v175.26,28.45 v222.25,28.45 v270.51,28.45
  Signal 0.406: v270.51,28.45 v318.77,28.45 v367.67,28.45
  VCC 0.406: v144.91,48.77 144.91,31.91 145.1,31.71 145.1,30.8 143.64,29.34 v143.64,28.45
SCK_MS_A_0
  GND_TOP 0.406: U027.6 31.75,25.4 32.38,26.04 35.56,26.04 36.2,25.4 36.2,13.97 34.92,12.7 31.75,12.7 X001.5
SCK_MS_A_1
  GND_TOP 0.406: X005.5 79.77,12.94 83.42,12.94 85.09,14.61 85.09,25.4 84.45,26.04 80.01,26.04 79.38,25.4 U010.6
SCK_MS_A_2
  GND_TOP 0.406: U032.6 128.27,25.4 128.91,26.04 131.44,26.04 132.08,25.4 132.08,14.61 130.18,12.7 127,12.7 X008.5
SCK_MS_A_3
  GND_TOP 0.406: U013.6 175.26,25.4 175.9,26.04 178.44,26.04 179.71,24.77 179.71,14.61 177.8,12.7 175.26,12.7 X011.5
SCK_MS_A_4
  GND_TOP 0.406: X014.5 223.52,12.7 225.43,12.7 227.33,14.61 227.33,24.77 225.43,26.67 222.88,26.67 222.25,26.04 U034.6
SCK_MS_A_5
  GND_TOP 0.406: U036.6 270.51,25.4 271.14,26.04 273.69,26.04 275.59,24.13 275.59,14.61 273.69,12.7 271.14,12.7 270.51,13.34 X017.5
SCK_MS_A_6
  GND_TOP 0.406: U038.6 318.77,25.4 319.4,26.04 321.94,26.04 323.21,24.77 323.21,13.97 321.94,12.7 319.4,12.7 X020.5
SCK_MS_A_7
  GND_TOP 0.406: U040.6 367.67,25.4 368.3,26.04 370.21,26.04 370.87,25.38 372.11,24.13 372.11,13.97 370.84,12.7 368.3,12.7 X023.5
SCK_MS_B_0
  GND_TOP 0.406: U027.5 30.48,26.04 31.11,26.67 36.2,26.67 37.15,25.72 37.15,13.34 35.24,11.43 31.56,11.43 29.21,13.78 X001.4
SCK_MS_B_1
  GND_TOP 0.406: U010.5 78.11,25.4 79.38,26.67 85.09,26.67 86.36,25.4 86.36,14.61 83.82,12.06 78.74,12.06 77.47,13.34 X005.4
SCK_MS_B_2
  GND_TOP 0.406: U032.5 127,25.4 128.27,26.67 132.08,26.67 133.35,25.4 133.35,14.61 130.81,12.06 126.17,12.06 124.46,13.78 X008.4
SCK_MS_B_3
  GND_TOP 0.406: U013.5 173.99,25.4 175.26,26.67 179.07,26.67 180.97,24.77 180.97,14.61 178.44,12.06 174.43,12.06 172.72,13.78 X011.4
SCK_MS_B_4
  GND_TOP 0.406: U034.5 220.98,26.04 222.25,27.3 226.06,27.3 227.97,25.4 227.97,13.97 226.06,12.06 222.25,12.06 220.98,13.34 X014.4
SCK_MS_B_5
  GND_TOP 0.406: U036.5 269.24,25.4 270.51,26.67 274.32,26.67 276.86,24.13 276.86,14.61 274.32,12.06 270.38,12.06 269.24,13.21 X017.4
SCK_MS_B_6
  GND_TOP 0.406: U038.5 317.5,25.4 318.77,26.67 322.58,26.67 323.85,25.4 323.85,13.34 322.58,12.06 318.13,12.06 316.87,13.34 X020.4
SCK_MS_B_7
  GND_TOP 0.406: U040.5 366.39,26.04 367.03,26.67 370.84,26.67 373.38,24.13 373.38,13.97 371.48,12.06 367.03,12.06 365.76,13.34 X023.4
SCK_SM_0  (via drill 0.6)
  GND_TOP 0.406: IC11.13 163.07,63.23 v162.56,63.74 | U028.2 25.4,33.02 22.86,35.56 v22.86,61.34
  Signal 0.406: v162.56,63.74 25.26,63.74 v22.86,61.34
SCK_SM_1  (via drill 0.6)
  GND_TOP 0.406: U029.2 73.03,32.48 70.29,35.22 70.29,44.77 v70.23,44.83 | v161.54,62.37 161.8,62.12 IC11.14
  Signal 0.406: v70.23,44.83 87.77,62.37 v161.54,62.37
SCK_SM_2  (via drill 0.6)
  GND_TOP 0.406: v121.92,33.27 U033.2 | IC11.15 160.4,60.35 160.4,56.64 159.71,55.95 151.37,55.95 151.05,55.63 123.19,55.63 122.17,54.61 v122.17,48.77
  VCC 0.406: v122.17,48.77 122.17,35.94 | 122.17,35.94 122.17,33.53 v121.92,33.27 | 122.17,35.94
SCK_SM_3  (via drill 0.6)
  GND_TOP 0.406: U014.2 168.91,33.02 168.33,33.6 168.33,34.11 167.84,34.6 167.33,34.6 164.97,36.96 v163.7,36.96 | v159.26,48.77 IC11.1
  VCC 0.406: v163.7,36.96 159.26,41.4 v159.26,48.77
SCK_SM_4  (via drill 0.6)
  GND_TOP 0.406: U035.2 v215.9,33.91 | IC11.2 160.53,49.02 v160.78,48.77
  Signal 0.406: v160.78,48.77 161.93,47.62 v215.26,47.62
  VCC 0.406: v215.9,33.91 215.9,46.99 v215.26,47.62
SCK_SM_5  (via drill 0.6)
  GND_TOP 0.406: U037.2 v264.8,42.93 | IC11.3 161.8,49.15 v162.18,48.77
  Signal 0.406: v162.31,42.93 v264.8,42.93
  VCC 0.406: v162.18,48.77 162.31,48.64 v162.31,42.93
SCK_SM_6  (via drill 0.6)
  GND_TOP 0.406: U039.2 v312.42,43.94 | IC11.4 163.07,49.4 v163.7,48.77
  Signal 0.406: v164.08,43.94 v312.42,43.94
  VCC 0.406: v163.7,48.77 164.08,48.39 v164.08,43.94
SCK_SM_7  (via drill 0.6)
  GND_TOP 0.406: IC11.12 164.34,58.8 v164.59,58.55 | v361.31,33.27 U041.2
  Signal 0.406: v164.59,58.55 360.05,58.55 v361.19,57.4
  VCC 0.406: v361.19,57.4 361.19,33.4 v361.31,33.27
SCK_SM_A_0
  GND_TOP 0.406: U028.8 26.67,23.56 R001.2 29.52,18.73 X001.6
SCK_SM_A_1
  GND_TOP 0.406: X005.6 80.01,17.46 R004.2 76.48,20.95 75.4,22.04 75.12,22.04 74.3,22.86 U029.8
SCK_SM_A_2
  GND_TOP 0.406: X008.6 126.05,17.46 R006.2 123.19,23.81 U033.8
SCK_SM_A_3
  GND_TOP 0.406: X011.6 173.03,18.73 R008.2 171.13,22.86 170.18,22.86 U014.8
SCK_SM_A_4
  GND_TOP 0.406: X014.6 223.52,17.46 R010.2 219.99,20.95 218.91,22.04 218.63,22.04 217.17,23.5 U035.8
SCK_SM_A_5
  GND_TOP 0.406: X017.6 271.78,18.09 R012.2 268.73,21.11 268,21.84 267.81,22.04 266.89,22.04 266.06,22.86 U037.8
SCK_SM_A_6
  GND_TOP 0.406: X020.6 319.4,18.09 R014.2 314.64,22.86 313.69,22.86 U039.8
SCK_SM_A_7
  GND_TOP 0.406: U041.8 362.58,23.18 R016.2 364.81,20 X023.6
SCK_SM_B_0
  GND_TOP 0.406: U028.7 25.4,22.93 R001.1 27.62,20.32 27.94,20 X001.3
SCK_SM_B_1
  GND_TOP 0.406: U029.7 73.03,22.55 R004.1 76.2,19.37 X005.3
SCK_SM_B_2
  GND_TOP 0.406: U033.7 121.92,23.18 R006.1 124.14,17.66 123.43,16.94 123.43,14.21 X008.3
SCK_SM_B_3
  GND_TOP 0.406: U014.7 168.91,22.86 170.81,20.95 R008.1 171.13,17.02 171.21,16.94 171.21,14.21 X011.3
SCK_SM_B_4
  GND_TOP 0.406: X014.3 219.47,14.21 219.47,16.94 218.12,18.29 R010.1 216.06,23.02 216.06,24.07 U035.7
SCK_SM_B_5
  GND_TOP 0.406: X017.3 267.73,14.21 267.73,16.94 267.02,17.65 R012.1 264.8,23.18 U037.7
SCK_SM_B_6
  GND_TOP 0.406: U039.7 312.42,23.18 R014.1 315.6,20 X020.3
SCK_SM_B_7
  GND_TOP 0.406: U041.7 361.31,22.55 R016.1 362.9,18.29 364.25,16.94 364.25,14.21 X023.3
SCKI  (via drill 0.6)
  GND_TOP 0.406: U002.4 142.24,85.41 R002.2 141.86,85.03 v141.86,68.71 | IC11.5 164.34,56.01 163.83,56.52 v163.83,56.64
  Signal 0.406: v163.83,56.64 v142.49,56.7
  VCC 0.406: v142.49,56.7 142.49,68.07 v141.86,68.71
SCKO_F
  GND_TOP 0.406: U820.1 144.78,69.72 146.18,68.33 U024.4
VDD0  (via drill 0.6, 0.9)
  GND_TOP 0.406: 45.09,31.58 C001.1 | v45.09,34.92 45.09,31.58 | X000.7 52.7,13.97 55.88,17.14 v55.88,20.95 | C058.1 52.7,31.96 | U025.1 45.09,31.58 | 52.7,31.96 v52.7,34.92 | U028.1 26.67,35.66 | 26.67,35.66 C000.1 | 52.7,31.96 U026.1 | v28.54,35.56 26.77,35.56 26.67,35.66 | v36.32,35.56 C059.1 34.29,35.47 U027.1
  GND_TOP 0.813: 18.63,23.5 C040.1 | C040.1 18.63,27.11 IC1.2 | 18.63,23.5 18.63,22.44 v17.78,21.59 | C040.1 18.63,25.3 18.63,23.5
  pour VCC: 13.97,40.64 57.15,40.64 57.15,0 19.05,0 19.05,19.05 13.97,19.05
VDD1  (via drill 0.6, 0.9)
  GND_TOP 0.406: U029.1 74.51,30.59 C060.1 v76.67,35.56 | U010.1 81.92,35.14 C061.1 v83.78,35.56 | U001.1 93.34,31.46 C023.1 93.34,32.04 v93.34,34.92 | U009.1 100.97,31.46 | 100.97,31.46 C024.1 | v100.97,34.92 100.97,31.46 | X004.7 101.6,13.97 104.14,16.51 v104.14,21.59
  GND_TOP 0.813: v65.41,21.59 65.61,21.59 66.89,22.87 66.89,22.88 66.99,22.98 C042.1 66.99,27.01 IC2.2
  pour VCC: 62.23,40.64 105.41,40.64 105.41,0 62.23,0
VDD2  (via drill 0.6, 0.9)
  GND_TOP 0.406: U033.1 123.19,35.77 C026.1 v124.97,36.2 | U032.1 130.81,32.6 129.75,33.66 C062.1 129.54,36.41 131.91,36.41 v131.95,36.45 | U030.1 140.97,31.46 141.12,31.6 | 141.12,31.6 C025.1 | U031.1 148.59,31.71 | 148.59,31.71 C063.1 | X007.7 149.86,13.97 151.13,15.24 v151.13,20.7 | v140.97,35.56 140.97,31.75 141.12,31.6 | v148.59,35.56 148.59,31.71
  GND_TOP 0.813: IC3.2 115.15,27.11 115.15,25.5 C044.1 115.25,22.54 v114.3,21.59
  pour VCC: 110.49,40.64 152.4,40.64 152.4,0 110.49,0
VDD3  (via drill 0.6, 0.9)
  GND_TOP 0.406: U014.1 170.18,29.84 170.27,29.93 C064.1 v171.79,36.2 | v199.39,20.95 199.39,15.88 197.49,13.97 X010.7 | U011.1 188.76,28 C065.1 v188.76,37.21 | U012.1 196.22,27.3 196.38,27.47 C028.1 v196.38,37.21 | U013.1 177.8,30.02 177.89,29.93 C027.1 v179.79,36.2
  GND_TOP 0.813: 162.24,25.74 C046.1 162.24,22.48 | IC4.2 161.03,26.95 162.24,25.74 | 162.24,25.74 162.24,22.48 | 162.24,22.48 162.24,21.91 v161.29,20.95
  pour VCC: 157.48,40.64 200.66,40.64 200.66,0 157.48,0
VDD4  (via drill 0.6, 0.9)
  GND_TOP 0.406: U035.1 217.17,35.52 C067.1 217.17,35.6 v217.17,37.21 | U034.1 224.79,35.52 C029.1 224.79,35.6 v224.79,37.21 | U016.1 243.84,31.71 | 243.84,31.71 C066.1 | U015.1 236.22,31.71 | 236.22,31.71 C030.1 | v247.01,20.95 247.01,16.51 244.47,13.97 X013.7 | v243.84,34.54 243.84,31.71 | v236.22,34.54 236.22,31.71
  GND_TOP 0.813: IC5.2 209.29,26.51 210.5,25.3 C048.1 210.5,21.27 v210.19,20.95
  pour VCC: 205.74,40.64 248.92,40.64 248.92,0 205.74,0
VDD5  (via drill 0.6, 0.9)
  GND_TOP 0.305: U037.1 266.1,30.42 C069.1 266.06,34.96 v266.06,36.83
  GND_TOP 0.406: U037.1 266.06,34.96 | C069.1 266.1,36.79 v266.06,36.83 | U036.1 273.05,34.89 C031.1 273.09,36.79 v273.05,36.83 | 283.21,31.71 C032.1 283.25,33.62 v283.21,34.29 283.21,31.71 | 283.21,31.71 U017.1 | C068.1 290.83,31.71 | 290.83,31.71 U018.1 | v295.27,20.95 295.27,16.51 292.74,13.97 X016.7 | v290.83,34.29 290.83,31.71
  GND_TOP 0.813: IC6.2 257.55,26.48 258.76,25.27 C050.1 258.76,21.27 v258.44,20.95
  pour VCC: 254,40.64 297.18,40.64 297.18,0 254,0
VDD6  (via drill 0.6, 0.9)
  GND_TOP 0.406: U039.1 C071.1 313.69,34.96 v313.69,36.83 | C033.1 321.31,34.89 | 321.31,34.89 U038.1 | v321.31,36.83 321.31,34.89 | v343.54,20.32 343.54,16.51 341,13.97 X019.7 | C070.1 340.36,31.71 | 340.36,31.71 U020.1 | C034.1 332.74,31.71 | 332.74,31.71 U019.1 | v332.74,34.29 332.74,31.71 | v340.36,34.29 340.36,31.71
  GND_TOP 0.813: 306.95,25.38 306.95,24.2 C052.1 307.02,23.75 | 307.02,23.75 307.02,21.27 v305.44,19.68 | IC7.2 305.81,26.51 306.95,25.38 | 306.95,25.38 306.95,23.82 307.02,23.75
  pour VCC: 301.62,40.64 344.81,40.64 344.81,0 301.62,0
VDD7  (via drill 0.6, 0.9)
  GND_TOP 0.406: v391.8,20.32 391.8,16.51 389.25,13.97 X022.7 | v362.58,36.83 362.58,34.71 | v370.2,36.83 370.2,34.71 | C073.1 362.58,34.71 | 362.58,34.71 U041.1 | C036.1 370.2,34.71 | 370.2,34.71 U040.1 | U021.1 380.37,31.71 | 380.37,31.71 C037.1 | U022.1 387.99,31.71 | 387.99,31.71 C072.1 | v380.37,34.92 380.37,31.71 | v387.99,34.92 387.99,31.71
  GND_TOP 0.813: v354.96,21.59 355.53,22.16 C054.1 355.53,25.74 354.32,26.95 IC8.2
  pour VCC: 393.7,0 350.52,0 350.52,40.64 393.7,40.64

## Text on the board
tNames: SCKO (SCK_MS) | FUNCTION_0 | FUNCTION_1 | SCKI (SCK_SM) | BOARD_2 | BOARD_1 | BOARD_0 | MISO | MOSI | DATA/SCK | BRD/FUNCTION | DATA/SCK | BRD/FUNCTION | DATA/SCK | BRD/FUNCTION | DATA/SCK | BRD/FUNCTION | DATA/SCK | BRD/FUNCTION | DATA/SCK | BRD/FUNCTION | DATA/SCK | BRD/FUNCTION | DATA/SCK | BRD/FUNCTION